# Altium schematic sheet Func.SchDoc
size A4; DocumentNumber: 1; SheetNumber: 1; SheetTotal: 3
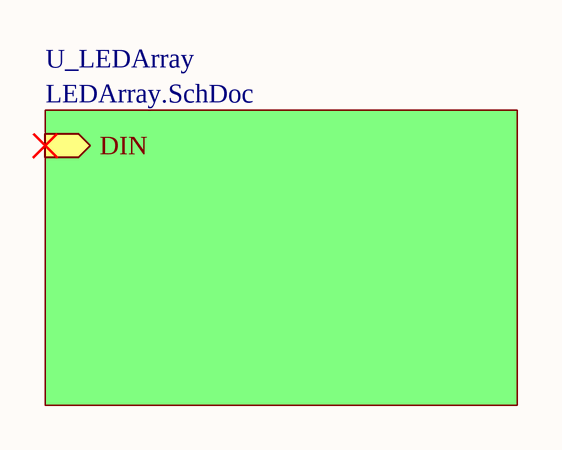
[diagram p0: Func.SchDoc]

## Sub-sheets
U_LEDArray = LEDArray.SchDoc: DIN (in)